# EAGLE schematic Aux_System (EAGLE 9.2.2)
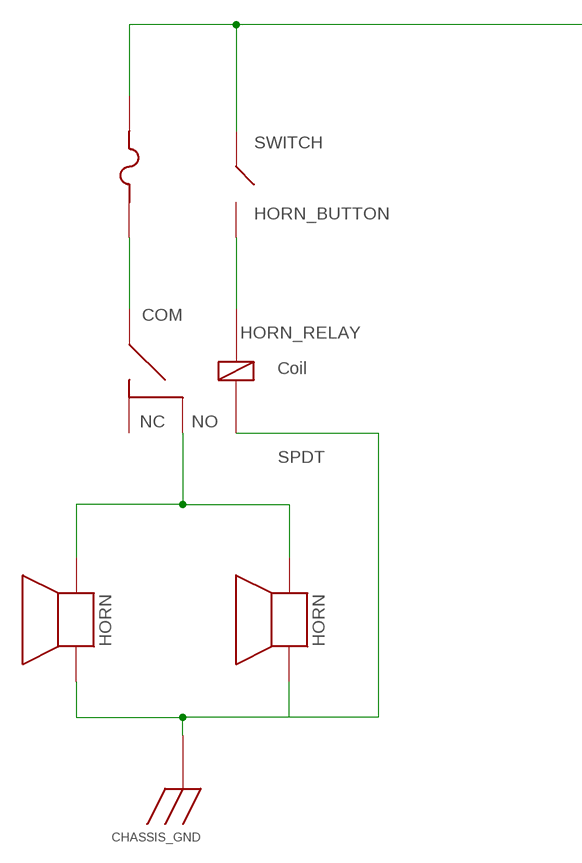
[diagram p0: schematic, sheet 1, part 1 of 2]
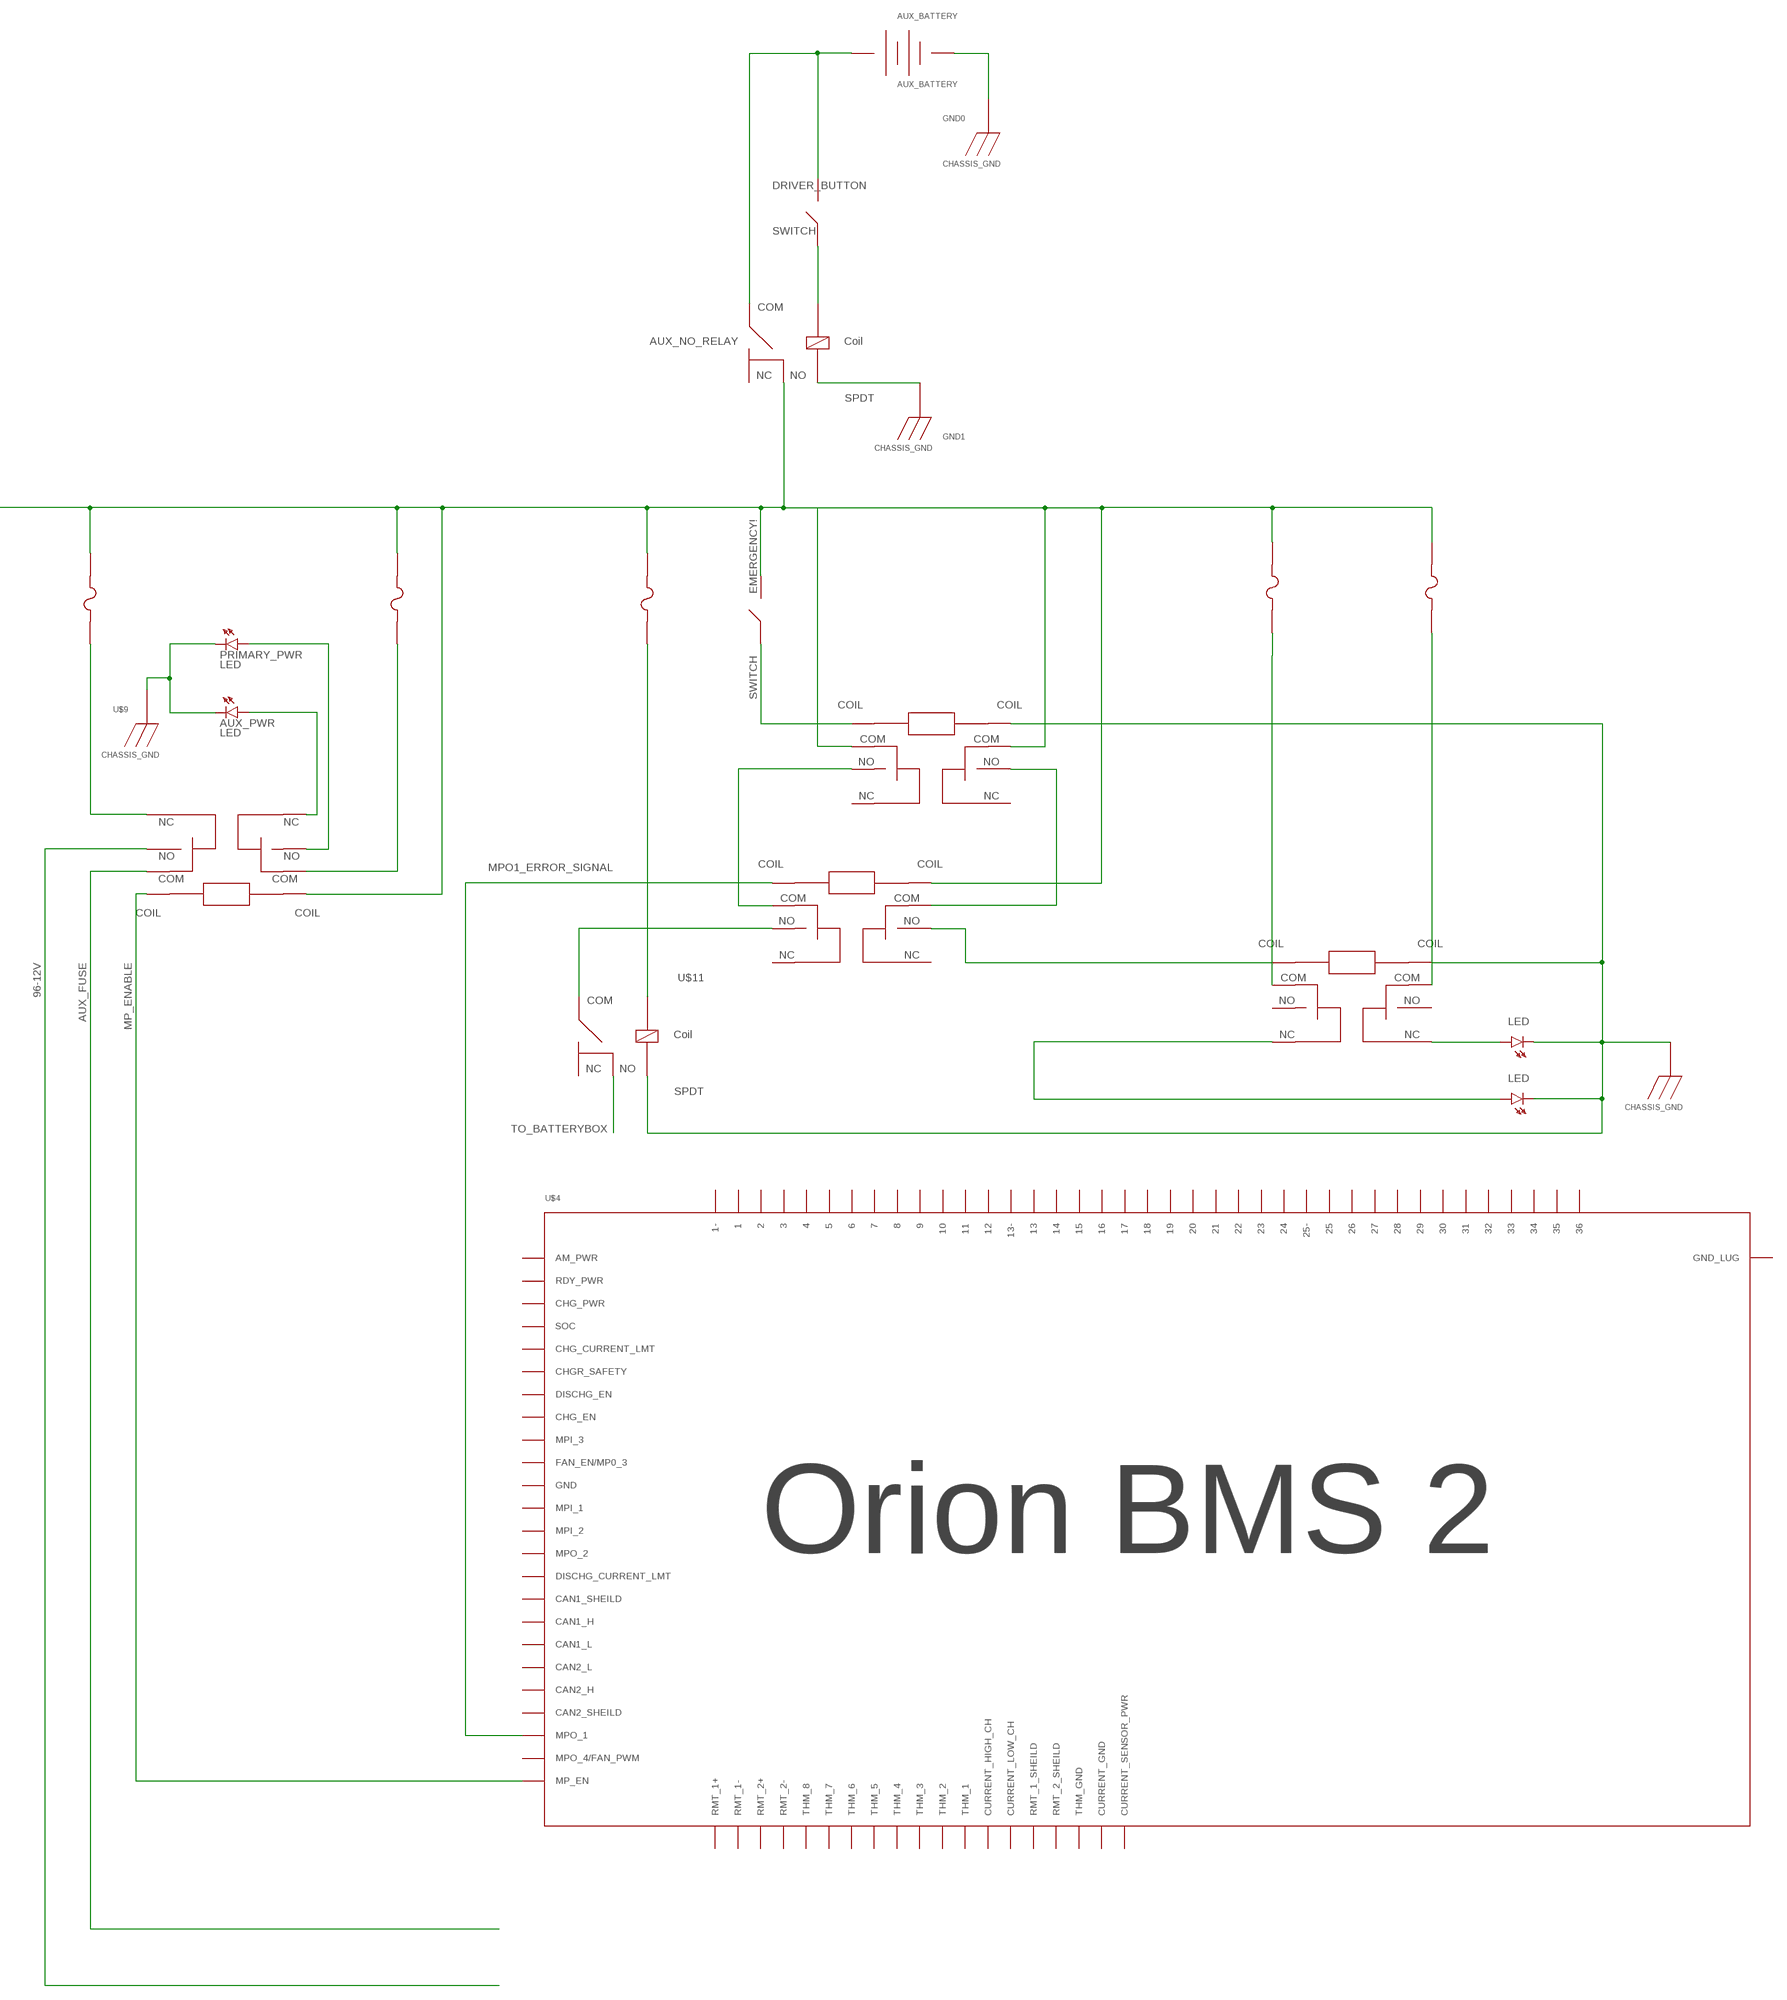
[diagram p1: schematic, sheet 1, part 2 of 2]

## Parts
AUX_BATTERY  AUX_BATTERY  [35_PIN]
AUX_NO_RELAY  SPDT  [35_PIN]
AUX_PWR  LED  [35_PIN]
DRIVER_BUTTON  SWITCH  [35_PIN]
EMERGENCY!  SWITCH  [35_PIN]
GND0  CHASSIS_GND  [35_PIN]
GND1  CHASSIS_GND  [35_PIN]
HORN_BUTTON  SWITCH  [35_PIN]
HORN_RELAY  SPDT  [35_PIN]
PRIMARY_PWR  LED  [35_PIN]
U$1  FUSE  [FUSE]
U$2  DPDT  [35_PIN]
U$3  CHASSIS_GND  [35_PIN]
U$4  BMSORION_BMS_2  [GNERIC_PADS]
U$5  DPDT  [35_PIN]
U$6  HORN  [35_PIN]
U$7  HORN  [35_PIN]
U$8  DPDT  [35_PIN]
U$9  CHASSIS_GND  [35_PIN]
U$10  DPDT  [35_PIN]
U$11  SPDT  [35_PIN]
U$12  LED  [35_PIN]
U$13  LED  [35_PIN]
U$14  CHASSIS_GND  [35_PIN]
U$15  FUSE  [FUSE]
U$16  FUSE  [FUSE]
U$17  FUSE  [FUSE]
U$18  FUSE  [FUSE]
U$19  FUSE  [FUSE]

## Nets
96-12V: U$2.P$2
AUX_FUSE: U$2.P$3
MP_ENABLE: U$2.P$7 U$4.P$66(MP_EN)
MPO1_ERROR_SIGNAL: U$4.P$63(MPO_1) U$10.P$8
N$1: AUX_BATTERY.P$2 GND0.P$1
N$2: AUX_BATTERY.P$1 AUX_NO_RELAY.P$2 DRIVER_BUTTON.P$2
N$3: AUX_NO_RELAY.P$1 DRIVER_BUTTON.P$1
N$4: AUX_NO_RELAY.P$3 GND1.P$1
N$5: U$5.P$8 U$10.P$2
N$6: HORN_BUTTON.P$2 HORN_RELAY.P$1
N$7: HORN_RELAY.P$3 U$7.P$1
N$8: U$3.P$1 U$6.P$1
N$9: PRIMARY_PWR.P$1(A) U$2.P$5
N$10: HORN_RELAY.P$5 U$6.P$2 U$7.P$2
N$11: AUX_PWR.P$1(A) U$2.P$4
N$12: AUX_PWR.P$2(K) PRIMARY_PWR.P$2(K) U$9.P$1
N$13: EMERGENCY!.P$1 U$8.P$8
N$14: U$8.P$6
N$15: AUX_NO_RELAY.P$5 EMERGENCY!.P$2 HORN_BUTTON.P$1 U$1.P$2 U$2.P$8 U$8.P$3 U$10.P$7 U$15.P$2 U$16.P$2 U$17.P$2 U$18.P$2 U$19.P$2
N$16: U$8.P$5 U$10.P$6
N$17: U$8.P$2 U$10.P$3
N$18: U$10.P$5 U$11.P$2
N$19: HORN_RELAY.P$2 U$1.P$1
N$20: U$5.P$4 U$12.P$1(A)
N$21: U$5.P$1 U$13.P$1(A)
N$22: U$5.P$3 U$17.P$1
N$23: U$2.P$1 U$16.P$1
N$24: U$11.P$1 U$15.P$1
N$25: U$5.P$7 U$8.P$7 U$11.P$3 U$12.P$2(K) U$13.P$2(K) U$14.P$1
N$26: U$5.P$6 U$18.P$1
N$27: U$2.P$6 U$19.P$1
TO_BATTERYBOX: U$11.P$5
Unconnected: AUX_NO_RELAY.P$4 HORN_RELAY.P$4 U$4.P$1 U$4.P$2(1-) U$4.P$3 U$4.P$4 U$4.P$5 U$4.P$6 U$4.P$7 U$4.P$8 U$4.P$9 U$4.P$10 U$4.P$11 U$4.P$12 U$4.P$13 U$4.P$14 U$4.P$15(13-) U$4.P$16 U$4.P$17 U$4.P$18 U$4.P$19 U$4.P$20 U$4.P$21 U$4.P$22 U$4.P$23 U$4.P$24 U$4.P$25 U$4.P$26 U$4.P$27 U$4.P$28(25-) U$4.P$29 U$4.P$30 U$4.P$31 U$4.P$32 U$4.P$33 U$4.P$34 U$4.P$35 U$4.P$36 U$4.P$37 U$4.P$38 U$4.P$39 U$4.P$40(AM_PWR) U$4.P$41(CAN1_H) U$4.P$42(CAN1_L) U$4.P$43(CAN1_SHEILD) U$4.P$44(CAN2_H) U$4.P$45(CAN2_L) U$4.P$46(CAN2_SHEILD) U$4.P$47(CHGR_SAFETY) U$4.P$48(CHG_CURRENT_LMT) U$4.P$49(CHG_EN) U$4.P$50(CHG_PWR) U$4.P$51(CURRENT_GND) U$4.P$52(CURRENT_HIGH_CH) U$4.P$53(CURRENT_LOW_CH) U$4.P$54(CURRENT_SENSOR_PWR) U$4.P$55(DISCHG_CURRENT_LMT) U$4.P$56(DISCHG_EN) U$4.P$57(FAN_EN/MP0_3) U$4.P$58(GND) U$4.P$59(GND_LUG) U$4.P$60(MPI_1) U$4.P$61(MPI_2) U$4.P$62(MPI_3) U$4.P$64(MPO_2) U$4.P$65(MPO_4/FAN_PWM) U$4.P$67(RDY_PWR) U$4.P$68(RMT_1+) U$4.P$69(RMT_1-) U$4.P$70(RMT_1_SHEILD) U$4.P$71(RMT_2+) U$4.P$72(RMT_2-) U$4.P$73(RMT_2_SHEILD) U$4.P$74(SOC) U$4.P$75(THM_1) U$4.P$76(THM_2) U$4.P$77(THM_3) U$4.P$78(THM_4) U$4.P$79(THM_5) U$4.P$80(THM_6) U$4.P$81(THM_7) U$4.P$82(THM_8) U$4.P$83(THM_GND) U$5.P$2 U$5.P$5 U$8.P$1 U$8.P$4 U$10.P$1 U$10.P$4 U$11.P$4

## Library data of the parts
AUX_BATTERY = Small_Scale_System - Copy:AUX_BATTERY: 12V Auxilary Battery
AUX_NO_RELAY HORN_RELAY U$11 = Small_Scale_System - Copy:SPDT
AUX_PWR PRIMARY_PWR U$12 U$13 = Small_Scale_System - Copy:LED
DRIVER_BUTTON EMERGENCY! HORN_BUTTON = Small_Scale_System - Copy:SWITCH
GND0 GND1 U$3 U$9 U$14 = Small_Scale_System - Copy:CHASSIS_GND: Chassis Ground
U$1 U$15-U$19 = Solar array design :FUSE: solar team library - FALL 2018 Design FALL 2018 Fuse
U$2 U$5 U$8 U$10 = Small_Scale_System - Copy:DPDT
U$4 = Battery:BMS: Orion BMS 2
U$6 U$7 = Small_Scale_System - Copy:HORN

## Module AUXBOX
Ports: 1(io)

### Library data of the parts